# Altium schematic sheet VoltageMonitor.SchDoc
size A4
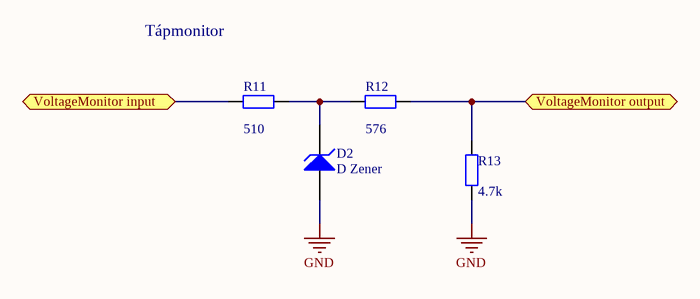
[diagram p0: VoltageMonitor.SchDoc]

## Parts
D2  D Zener  [AXIAL-0.4]
R11  value 510  [AXIAL-0.4]  (hidden comment: 500)
R12  576  [AXIAL-0.4]
R13  4.7k  [AXIAL-0.4]

## Ports
VoltageMonitor input, VoltageMonitor output (bidir)

## Nets
GND: D2.1(A) R13.2
VoltageMonitor input: R11.2 ; port VoltageMonitor input
VoltageMonitor output: R12.1 R13.1 ; port VoltageMonitor output
NetD2_2: D2.2(K) R11.1 R12.2

## Notes on the sheet
- Tápmonitor

## Library data of the parts
D2 = D Zener: Zener Diode; Published: 8-Jun-2000; LatestRevisionDate: 17-Jul-2002; LatestRevisionNote: Re-released for DXP Platform.; PackageReference: DIODE-0.7; Publisher: Altium Limited; PackageDescription: Diode, Thru-Hole; 2 Leads; 0.7 in Pin Spacing
R11-R13 = res2: Resistor; Published: 8-Jun-2000; LatestRevisionDate: 17-Jul-2002; LatestRevisionNote: Re-released for DXP Platform.; PackageReference: AXIAL-0.4; Publisher: Altium Limited; PackageDescription: Axial Device, Thru-Hole; 2 Leads; 0.4 in Pin Spacing
  R12: Value: 576
  R13: Value: 4.7k